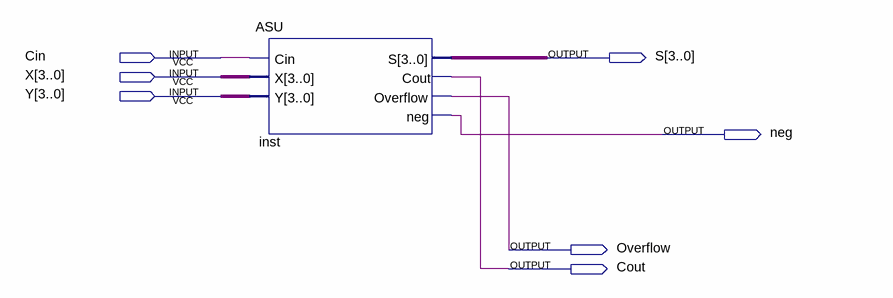
[diagram p0: schematic sheet]
// Quartus schematic CombinedASU1.bdf as structural Verilog: 1 symbols, 7 pins
module CombinedASU1 (
  input  Cin,
  input  [3:0] X,
  input  [3:0] Y,
  output [3:0] S,
  output neg,
  output Overflow,
  output Cout
);

  ASU inst (.Cin(Cin), .X(X), .Y(Y), .S(S), .Cout(Cout), .Overflow(Overflow), .neg(neg));
endmodule
